# Altium schematic sheet way2.SchDoc
size A4
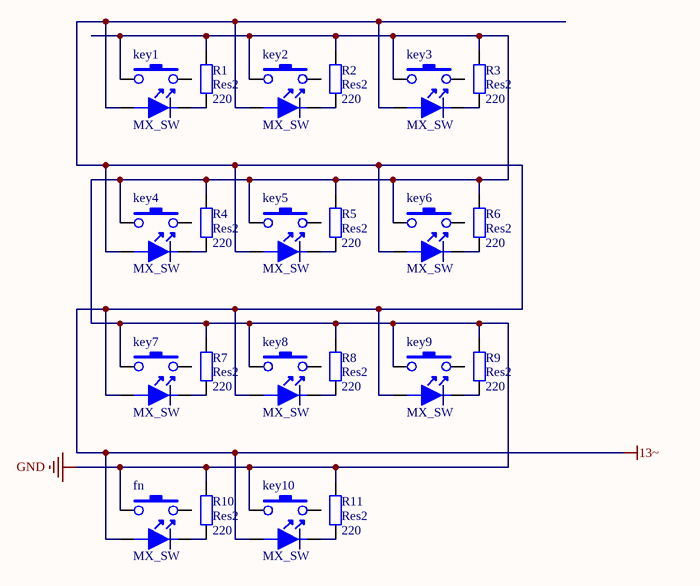
[diagram p0: way2.SchDoc]

## Parts
fn  MX_SW  [MX_SW-2]
key1  MX_SW  [MX_SW-2]
key2  MX_SW  [MX_SW-2]
key3  MX_SW  [MX_SW-2]
key4  MX_SW  [MX_SW-2]
key5  MX_SW  [MX_SW-2]
key6  MX_SW  [MX_SW-2]
key7  MX_SW  [MX_SW-2]
key8  MX_SW  [MX_SW-2]
key9  MX_SW  [MX_SW-2]
key10  MX_SW  [MX_SW-2]
R1  Res2  value 220  [AXIAL-0.4]
R2  Res2  value 220  [AXIAL-0.4]
R3  Res2  value 220  [AXIAL-0.4]
R4  Res2  value 220  [AXIAL-0.4]
R5  Res2  value 220  [AXIAL-0.4]
R6  Res2  value 220  [AXIAL-0.4]
R7  Res2  value 220  [AXIAL-0.4]
R8  Res2  value 220  [AXIAL-0.4]
R9  Res2  value 220  [AXIAL-0.4]
R10  Res2  value 220  [AXIAL-0.4]
R11  Res2  value 220  [AXIAL-0.4]

## Nets
13~: fn.3 key1.3 key2.3 key3.3 key4.3 key5.3 key6.3 key7.3 key8.3 key9.3 key10.3
GND: fn.1 key1.1 key2.1 key3.1 key4.1 key5.1 key6.1 key7.1 key8.1 key9.1 key10.1 R1.2 R2.2 R3.1 R4.1 R5.1 R6.1 R7.1 R8.1 R9.1 R10.1 R11.1
Netfn_4: fn.4 R10.2
Netkey1_4: key1.4 R1.1
Netkey2_4: key2.4 R2.1
Netkey3_4: key3.4 R3.2
Netkey4_4: key4.4 R4.2
Netkey5_4: key5.4 R5.2
Netkey6_4: key6.4 R6.2
Netkey7_4: key7.4 R7.2
Netkey8_4: key8.4 R8.2
Netkey9_4: key9.4 R9.2
Netkey10_4: key10.4 R11.2

Not connected (* = marked no-connect by the designer): fn 2; key1 2; key2 2; key3 2; key4 2; key5 2; key6 2; key7 2; key8 2; key9 2; key10 2

## Library data of the parts
fn key1-key10 = MX_SW-2: without Fixation pins  1-Pole w/LED
R1-R11 = Res2: Resistor; Published: 8-Jun-2000; LatestRevisionDate: 17-Jul-2002; LatestRevisionNote: Re-released for DXP Platform.; PackageReference: AXIAL-0.4; Publisher: Altium Limited; PackageDescription: Axial Device, Thru-Hole; 2 Leads; 0.4 in Pin Spacing